# Altium schematic sheet maincont.SchDoc
size A
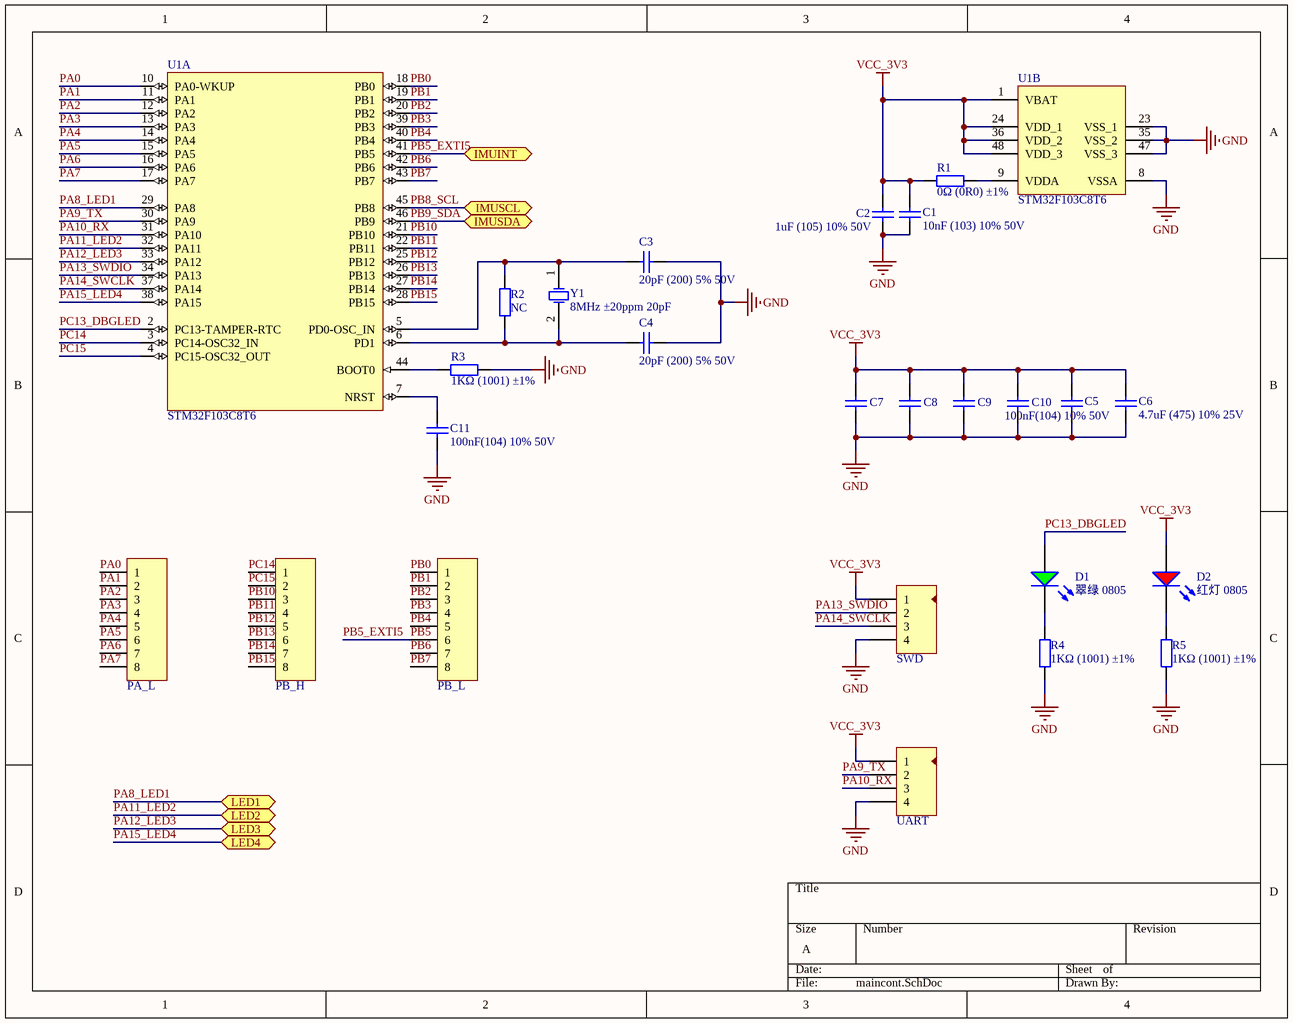
[diagram p0: maincont.SchDoc]

## Parts
C1  10nF (103) 10% 50V  [LC-0805_C]
C2  1uF (105) 10% 50V  [LC-0805_C]
C3  20pF (200) 5% 50V  [LC-0805_C]
C4  20pF (200) 5% 50V  [LC-0805_C]
C5  100nF(104) 10% 50V  [LC-0805_C]
C6  4.7uF (475) 10% 25V  [LC-0805_C]
C7  100nF(104) 10% 50V  [LC-0805_C]  (value not drawn)
C8  100nF(104) 10% 50V  [LC-0805_C]  (value not drawn)
C9  100nF(104) 10% 50V  [LC-0805_C]  (value not drawn)
C10  100nF(104) 10% 50V  [LC-0805_C]  (value not drawn)
C11  100nF(104) 10% 50V  [LC-0805_C]
D1  翠绿 0805  [LC-0805_LED_S1]
D2  红灯 0805  [LC-0805_LED_S1]
P1  PA_L  [HDR1X8]
P2  PB_H  [HDR1X8]
P3  PB_L  [HDR1X8]
P4  SWD  [HDR4X1-2.54]
P5  UART  [HDR4X1-2.54]
R1  0Ω (0R0) ±1%  [LC-0805_R]
R2  NC  [LC-0805_R]
R3  1KΩ (1001) ±1%  [LC-0805_R]
R4  1KΩ (1001) ±1%  [LC-0805_R]
R5  1KΩ (1001) ±1%  [LC-0805_R]
U1  STM32F103C8T6  [LC-LQFP-48_7x7x05P]  (parts A,B of 2)
Y1  8MHz ±20ppm 20pF  [LC-SMD-5032_2P]

## Ports
IMUINT, IMUSCL, IMUSDA, LED1, LED2, LED3, LED4

## Nets
GND: C1.1 C2.1 C3.2 C4.2 C5.2 C6.1 C7.2 C8.2 C9.2 C10.2 C11.1 P4.4 P5.4 R3.2 R4.1 R5.1 U1.8(VSSA) U1.23(VSS_1) U1.35(VSS_2) U1.47(VSS_3)
VCC_3V3: C1.2 C2.2 C5.1 C6.2 C7.1 C8.1 C9.1 C10.1 D2.A P4.1 P5.1 R1.2 U1.1(VBAT) U1.24(VDD_1) U1.36(VDD_2) U1.48(VDD_3)
PA0: P1.1 U1.10(PA0-WKUP)
PA1: P1.2 U1.11(PA1)
PA2: P1.3 U1.12(PA2)
PA3: P1.4 U1.13(PA3)
PA4: P1.5 U1.14(PA4)
PA5: P1.6 U1.15(PA5)
PA6: P1.7 U1.16(PA6)
PA7: P1.8 U1.17(PA7)
PA8_LED1: U1.29(PA8) ; port LED1
PA9_TX: P5.2 U1.30(PA9)
PA10_RX: P5.3 U1.31(PA10)
PA11_LED2: U1.32(PA11) ; port LED2
PA12_LED3: U1.33(PA12) ; port LED3
PA13_SWDIO: P4.2 U1.34(PA13)
PA14_SWCLK: P4.3 U1.37(PA14)
PA15_LED4: U1.38(PA15) ; port LED4
PB0: P3.1 U1.18(PB0)
PB1: P3.2 U1.19(PB1)
PB2: P3.3 U1.20(PB2)
PB3: P3.4 U1.39(PB3)
PB4: P3.5 U1.40(PB4)
PB5: P3.6 U1.41(PB5) ; port IMUINT  [also labelled PB5_EXTI5]
PB6: P3.7 U1.42(PB6)
PB7: P3.8 U1.43(PB7)
PB8_SCL: U1.45(PB8) ; port IMUSCL
PB9_SDA: U1.46(PB9) ; port IMUSDA
PB10: P2.3 U1.21(PB10)
PB11: P2.4 U1.22(PB11)
PB12: P2.5 U1.25(PB12)
PB13: P2.6 U1.26(PB13)
PB14: P2.7 U1.27(PB14)
PB15: P2.8 U1.28(PB15)
PC13_DBGLED: D1.A U1.2(PC13-TAMPER-RTC)
PC14: P2.1 U1.3(PC14-OSC32_IN)
PC15: P2.2 U1.4(PC15-OSC32_OUT)
NetC3_1: C3.1 R2.1 U1.5(PD0-OSC_IN) Y1.1(OSC1)
NetC4_1: C4.1 R2.2 U1.6(PD1) Y1.2(OSC2)
NetC11_2: C11.2 U1.7(NRST)
NetD1_K: D1.K R4.2
NetD2_K: D2.K R5.2
NetR1_1: R1.1 U1.9(VDDA)
NetR3_1: R3.1 U1.44(BOOT0)

## Library data of the parts
C1 = 0805 10nF (103) 10% 50V: 贴片电容; ComponentLink1Description: 供应商链接; ComponentLink1URL: http://www.szlcsc.com/product/details_2062.html; Package: 0805; Supplier: LC; SuppliersPartNumber: C1710
C2 = 0805 1uF (105) 10% 50V: 贴片电容; ComponentLink1Description: 供应商链接; ComponentLink1URL: http://www.szlcsc.com/product/details_29074.html; Package: 0805; Supplier: LC; SuppliersPartNumber: C28323
C3 C4 = 0805 20pF (200) 5% 50V: 贴片电容; ComponentLink1Description: 供应商链接; ComponentLink1URL: http://www.szlcsc.com/product/details_2150.html; Package: 0805; Supplier: LC; SuppliersPartNumber: C1798
C5 C7-C11 = 0805 100nF(104) 10% 50V: 贴片电容; ComponentLink1Description: 供应商链接; ComponentLink1URL: http://www.szlcsc.com/product/details_50686.html; Package: 0805; Supplier: LC; SuppliersPartNumber: C49678
C6 = 0805 4.7uF (475) 10% 25V: 贴片电容; ComponentLink1Description: 供应商链接; ComponentLink1URL: http://www.szlcsc.com/product/details_2131.html; Package: 0805; Supplier: LC; SuppliersPartNumber: C1779
D1 = 0805 翠绿: 发光二极管; ComponentLink1Description: 供应商链接; ComponentLink1URL: http://www.szlcsc.com/product/details_2670.html; Package: 0805; Supplier: LC; SuppliersPartNumber: C2297
D2 = 0805 红灯: 发光二极管; ComponentLink1Description: 供应商链接; ComponentLink1URL: http://www.szlcsc.com/product/details_2668.html; Package: 0805; Supplier: LC; SuppliersPartNumber: C2295
P1-P3 = Header 8: Header, 8-Pin; LatestRevisionDate: 17-Jul-2002; LatestRevisionNote: Re-released for DXP Platform.; Publisher: Altium Limited
P4 P5 = Header 4: 接插件; LatestRevisionDate: 17-Jul-2002; LatestRevisionNote: Re-released for DXP Platform.; Publisher: Altium Limited
R1 = 0805 0Ω (0R0) 1%: 贴片电阻; ComponentLink1Description: 供应商链接; ComponentLink1URL: http://www.szlcsc.com/product/details_18165.html; Package: 0805; Supplier: LC; SuppliersPartNumber: C17477
R2 = 0805 1MΩ (1004) 1%: 贴片电阻; ComponentLink1Description: 供应商链接; ComponentLink1URL: http://www.szlcsc.com/product/details_18202.html; Package: 0805; Supplier: LC; SuppliersPartNumber: C17514
R3-R5 = 0805 1KΩ (1001) 1%: 贴片电阻; ComponentLink1Description: 供应商链接; ComponentLink1URL: http://www.szlcsc.com/product/details_18201.html; Package: 0805; Supplier: LC; SuppliersPartNumber: C17513
U1 = STM32F103C8T6: ARM; ComponentLink1Description: 供应商链接; ComponentLink1URL: http://www.szlcsc.com/product/details_9243.html; Package: LQFP-48_7x7x05P; Supplier: LC; SuppliersPartNumber: C8734
Y1 = SMD-5032_2P 8MHz 20ppm 20pF: 贴片晶振; ComponentLink1Description: 供应商链接; ComponentLink1URL: http://www.szlcsc.com/product/details_19261.html; Package: SMD-5032_2P; Supplier: LC; SuppliersPartNumber: C18560